# Altium schematic sheet SC945D_Micro.SchDoc: Micro
size 393 x 270 mm; CompanyName: Seccom; Address1: 521, rue du capt. François Garbit; Address2: 69440 Mornant; Address3: seccom@seccom.fr; Address4: www.seccom.fr; DocumentNumber: 4; SheetNumber: 4; SheetTotal: 9; PageSetup: Record=PageOptions|CenterHorizontal=True|CenterVertical=True|PrintScale=0.74|XCorrection=1.00|YCorrection=1.00|PrintKind=0|BorderSize=5000000|LeftOffset=0|BottomOffset=0|Orientation=2|PaperLength=1000|PaperWidth=1000|Scale=100|PaperSource=7|PrintQuality=-4|MediaType=1|DitherType=10|PaperKind=A4|PrintScaleMode=1
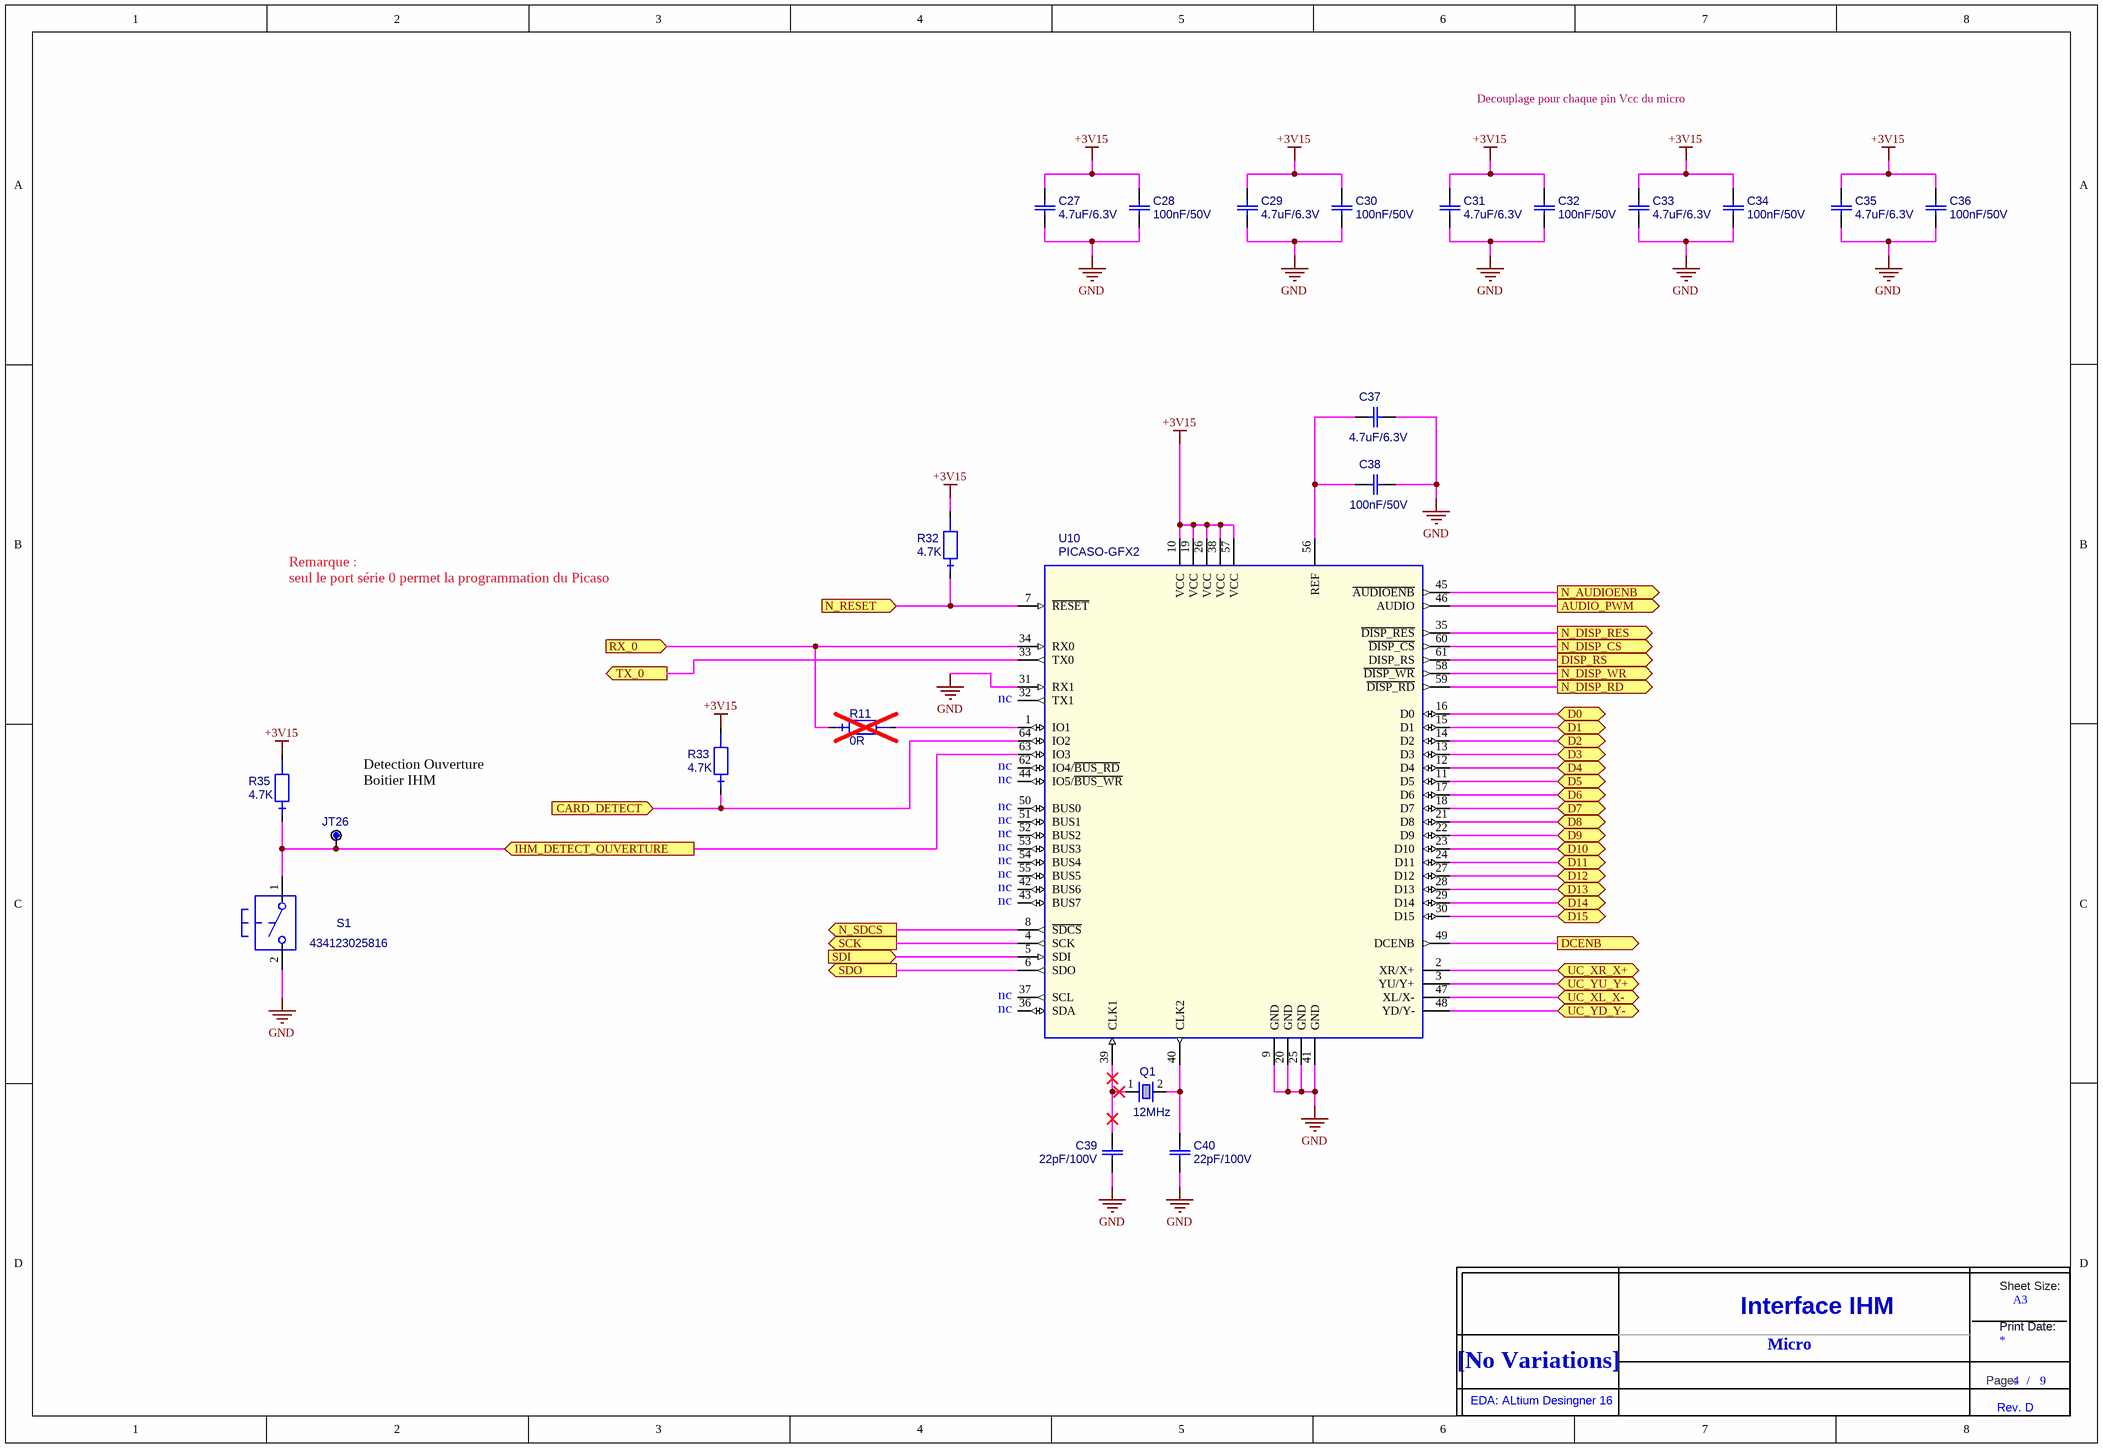
[diagram p0: SC945D_Micro.SchDoc]

## Parts
C27  value 4.7uF/6.3V  [0603_ReflowSoldering_CAP]  (hidden comment: C_0603_X5R_10%_4.7U-6.3V)
C28  value 100nF/50V  [0603_ReflowSoldering_CAP]  (hidden comment: C_0603_X7R_10%_100N-50V)
C29  value 4.7uF/6.3V  [0603_ReflowSoldering_CAP]  (hidden comment: C_0603_X5R_10%_4.7U-6.3V)
C30  value 100nF/50V  [0603_ReflowSoldering_CAP]  (hidden comment: C_0603_X7R_10%_100N-50V)
C31  value 4.7uF/6.3V  [0603_ReflowSoldering_CAP]  (hidden comment: C_0603_X5R_10%_4.7U-6.3V)
C32  value 100nF/50V  [0603_ReflowSoldering_CAP]  (hidden comment: C_0603_X7R_10%_100N-50V)
C33  value 4.7uF/6.3V  [0603_ReflowSoldering_CAP]  (hidden comment: C_0603_X5R_10%_4.7U-6.3V)
C34  value 100nF/50V  [0603_ReflowSoldering_CAP]  (hidden comment: C_0603_X7R_10%_100N-50V)
C35  value 4.7uF/6.3V  [0603_ReflowSoldering_CAP]  (hidden comment: C_0603_X5R_10%_4.7U-6.3V)
C36  value 100nF/50V  [0603_ReflowSoldering_CAP]  (hidden comment: C_0603_X7R_10%_100N-50V)
C37  value 4.7uF/6.3V  [0603_ReflowSoldering_CAP]  (hidden comment: C_0603_X5R_10%_4.7U-6.3V)
C38  value 100nF/50V  [0603_ReflowSoldering_CAP]  (hidden comment: C_0603_X7R_10%_100N-50V)
C39  value 22pF/100V  [0805_ReflowSoldering_CAP]  (hidden comment: C_0805_NPO_5%_22P-100V)
C40  value 22pF/100V  [0805_ReflowSoldering_CAP]  (hidden comment: C_0805_NPO_5%_22P-100V)
JT26  POINT_TEST_PAD_40MIL  [PAD_CMS_40X40_E]  (value not drawn)  (no BOM)
Q1  value 12MHz  [QUARTZ_HC49_11.5X5_CMS]  (hidden comment: QUARTZ_HC49/4HSMX_12M)
R11  value 0R  [0603_ReflowSoldering_RES]  (hidden comment: RES_0603_1%_100PPM_0R)  (no BOM)
R32  value 4.7K  [0603_ReflowSoldering_RES]  (hidden comment: RES_0603_1%_100PPM_4.7K)
R33  value 4.7K  [0603_ReflowSoldering_RES]  (hidden comment: RES_0603_1%_100PPM_4.7K)
R35  value 4.7K  [0603_ReflowSoldering_RES]  (hidden comment: RES_0603_1%_100PPM_4.7K)
S1  value 434123025816  [SWITCH_ON_MOM_WS_TRS_CMS]  (hidden comment: INTP_D_1C-1P_ON-MOM_434123025816)
Title_new?  DNI  (value not drawn)  (graphical)
U10  PICASO-GFX2  [QFP_064_E0,50_10X10MM]

## Ports
AUDIO_PWM (out), CARD_DETECT (in), D0 (bidir), D1 (bidir), D2 (bidir), D3 (bidir), D4 (bidir), D5 (bidir), D6 (bidir), D7 (bidir), D8 (bidir), D9 (bidir), D10 (bidir), D11 (bidir), D12 (bidir), D13 (bidir), D14 (bidir), D15 (bidir), DCENB (out), DISP_RS (out), IHM_DETECT_OUVERTURE (in), N_AUDIOENB (out), N_DISP_CS (out), N_DISP_RD (out), N_DISP_RES (out), N_DISP_WR (out), N_RESET (in), N_SDCS (out), RX_0 (in), SCK (out), SDI (in), SDO (out), TX_0 (out), UC_XL_X- (bidir), UC_XR_X+ (bidir), UC_YD_Y- (bidir), UC_YU_Y+ (bidir)

## Nets
+3V15: C27.2 C28.2 C29.2 C30.2 C31.2 C32.2 C33.2 C34.2 C35.2 C36.2 R32.2 R33.2 R35.2 U10.10(VCC) U10.19(VCC) U10.26(VCC) U10.38(VCC) U10.57(VCC)
GND: C27.1 C28.1 C29.1 C30.1 C31.1 C32.1 C33.1 C34.1 C35.1 C36.1 C37.1 C38.1 C39.1 C40.1 S1.2 U10.9(GND) U10.20(GND) U10.25(GND) U10.31(RX1) U10.41(GND)
AUDIO_PWM: U10.46(AUDIO) ; port AUDIO_PWM
CARD_DETECT: R33.1 U10.64(IO2) ; port CARD_DETECT
D0: U10.16(D0) ; port D0
D1: U10.15(D1) ; port D1
D2: U10.14(D2) ; port D2
D3: U10.13(D3) ; port D3
D4: U10.12(D4) ; port D4
D5: U10.11(D5) ; port D5
D6: U10.17(D6) ; port D6
D7: U10.18(D7) ; port D7
D8: U10.21(D8) ; port D8
D9: U10.22(D9) ; port D9
D10: U10.23(D10) ; port D10
D11: U10.24(D11) ; port D11
D12: U10.27(D12) ; port D12
D13: U10.28(D13) ; port D13
D14: U10.29(D14) ; port D14
D15: U10.30(D15) ; port D15
DCENB: U10.49(DCENB) ; port DCENB
DISP_RS: U10.61(DISP_RS) ; port DISP_RS
IHM_DETECT_OUVERTURE: JT26.1 R35.1 S1.1 U10.63(IO3) ; port IHM_DETECT_OUVERTURE
N_AUDIOENB: U10.45(~{AUDIOENB}) ; port N_AUDIOENB
N_DISP_CS: U10.60(~{DISP_CS}) ; port N_DISP_CS
N_DISP_RD: U10.59(~{DISP_RD}) ; port N_DISP_RD
N_DISP_RES: U10.35(~{DISP_RES}) ; port N_DISP_RES
N_DISP_WR: U10.58(~{DISP_WR}) ; port N_DISP_WR
N_RESET: R32.1 U10.7(~{RESET}) ; port N_RESET
N_SDCS: U10.8(~{SDCS}) ; port N_SDCS
RX_0: R11.1 U10.34(RX0) ; port RX_0
SCK: U10.4(SCK) ; port SCK
SDI: U10.5(SDI) ; port SDI
SDO: U10.6(SDO) ; port SDO
TX_0: U10.33(TX0) ; port TX_0
UC_XL_X-: U10.47(XL/X-) ; port UC_XL_X-
UC_XR_X+: U10.2(XR/X+) ; port UC_XR_X+
UC_YD_Y-: U10.48(YD/Y-) ; port UC_YD_Y-
UC_YU_Y+: U10.3(YU/Y+) ; port UC_YU_Y+
NetC37_2: C37.2 C38.2 U10.56(REF)
NetC39_2: C39.2 Q1.1 U10.39(CLK1)
NetC40_2: C40.2 Q1.2 U10.40(CLK2)
NetR11_2: R11.2 U10.1(IO1)

Not connected (* = marked no-connect by the designer): U10 32(TX1) 36(SDA) 37(SCL) 42(BUS6) 43(BUS7) 44(IO5/~{BUS_WR}) 50(BUS0) 51(BUS1) 52(BUS2) 53(BUS3) 54(BUS4) 55(BUS5) 62(IO4/~{BUS_RD})

## Notes on the sheet
- Decouplage pour chaque pin Vcc du micro
- Remarque :
  seul le port série 0 permet la programmation du Picaso
- (near U10) nc
- (near JT26) Detection Ouverture
  Boitier IHM
- Micro
- (in symbol Title_new) Sheet Size:; A3; Interface IHM; Print Date:; [No Variations]; Page:; /; EDA: ALtium Desingner 16; Rev. D

## Library data of the parts
C27 C29 C31 C33 C35 C37 = C_0603_X5R_10%_4.7U-6.3V: Condensateur céramique, X5R, 10%, CMS 0603, 4.7uF/6.3V; Creation: FB (29/02/12); Boitier: 0603; Remarque: {Remarque}; Fabricant: Kemet; Ref Fab: C0603C475K9PAC; Coeff: 1; ComponentLink1URL: O:\_Documentation\Datasheets\Kemet\Condos_Ceramic_X5R.pdf; ComponentLink2URL: o:\_Documentation\Datasheets\_BOITIERS\PASSIF_CMS\; Config: *; ComponentLink1Description: Datasheet; ComponentLink2Description: Datasheet Boitier; Supplier 1: Farnell; Supplier 2: RadioSpares; Supplier Part Number 1: 9227784; Supplier Part Number 2: 6911164
C28 C30 C32 C34 C36 C38 = C_0603_X7R_10%_100N-50V: Condensateur céramique, X7R, 10%, CMS 0603, 100nF/50V; Creation: FB (29/02/12); Boitier: 0603; Remarque: {Remarque}; Fabricant: Kemet; Ref Fab: C0603C104K5RAC; Coeff: 1; ComponentLink1URL: O:\_Documentation\Datasheets\Kemet\Condos_Ceramic_CMS.pdf; ComponentLink2URL: o:\_Documentation\Datasheets\_BOITIERS\PASSIF_CMS\; Config: *; ComponentLink1Description: Datasheet; ComponentLink2Description: Datasheet Boitier; Supplier 1: Farnell; Supplier Part Number 1: 1288255
C39 C40 = C_0805_NPO_5%_22P-100V: Condensateur céramique, NPO, 5%, CMS 0805; Creation: LJ; Verification: LJ (28/05/04); Boitier: 0805; Remarque: {Remarque}; Coeff: 1; Fabricant: AVX; Ref Fab: 08051A220JAT2A; ComponentLink1URL: o:\_Documentation\Datasheets\BC_Components\Condo_CMS_NPO-X7R-Y5V.pdf; ComponentLink2URL: o:\_Documentation\Datasheets\_BOITIERS\PASSIF_CMS\RC_0805_(2x1,25)_(Schneider).PDF; Config: *; ComponentLink1Description: Datasheet; ComponentLink2Description: Datasheet Boitier; Supplier 1: Farnell; Supplier 2: Mouser; Supplier Part Number 1: 317500; Supplier Part Number 2: 581-08051A220J
JT26 = POINT_TEST_PAD_40MIL: Point de test sur CI, pad de diamètre 1.016mm (40mils); Creation: FB (04/10/12); Remarque: {Remarque}; Coeff: 1; Value: POINT_TEST; Config: *; ComponentLink1Description: Datasheet; ComponentLink2Description: Datasheet Boitier
Q1 = QUARTZ_HC49/4HSMX_12M: Quartz CMS série HCM49 (équiv HC49/US), -10/+60°C, +/-30ppm, 18pF; Creation: FB (11/09/12); Fabricant: Citizen; Ref Fab: HCM49 12.000MABJ-UT; Coeff: 1; Verification: *; Boitier: HC49/4HSMX; Remarque: *; ComponentLink1URL: O:\_Documentation\Datasheets\Citizen\Quartz_HC49-US_HCM49.pdf; ComponentLink2URL: o:\_Documentation\Datasheets\_BOITIERS\; Config: *; ComponentLink1Description: Datasheet; ComponentLink2Description: Datasheet Boitier; Supplier 1: Farnell; Supplier Part Number 1: 1652567; Supplier 2: Mouser; Supplier Part Number 2: 695-HCM49-12-U
R11 = RES_0603_1%_100PPM_0R: Résistance, 0.100W, 1%, 100ppm, 75V, 0R; Creation: FB (04/07/12); Boitier: 0603; Remarque: {Remarque}; Fabricant: Vishay; Ref Fab: CRCW06030000Z0EA; Coeff: 1; Verification: *; ComponentLink1URL: O:\_Documentation\Datasheets\Vishay\Resistances_D-CRCWe3.pdf; ComponentLink2URL: o:\_Documentation\Datasheets\_BOITIERS\PASSIF_CMS\; Config: *; ComponentLink1Description: Datasheet; ComponentLink2Description: Datasheet Boitier; Supplier 1: Farnell; Supplier Part Number 1: 1469739
R32 R33 R35 = RES_0603_1%_100PPM_4.7K: Résistance, 0.100W, 1%, 100ppm, 75V, 4.7K; Creation: JPL (05/07/12); Boitier: 0603; Remarque: {Remarque}; Fabricant: Vishay; Ref Fab: CRCW06034K70FKEA; Coeff: 1; Verification: *; ComponentLink1URL: O:\_Documentation\Datasheets\Vishay\Resistances_D-CRCWe3.pdf; ComponentLink2URL: o:\_Documentation\Datasheets\_BOITIERS\PASSIF_CMS\; Config: *; ComponentLink1Description: Datasheet; ComponentLink2Description: Datasheet Boitier; Supplier 1: Farnell; Supplier 2: RadioSpares; Supplier Part Number 1: 1469807; Supplier Part Number 2: 6790484
S1 = INTP_D_1C-1P_ON-MOM_434123025816: Bouton poussoir, CI, 1 circuit, ON/MOM, droit, tactile, 50mA/12V, -40/+85°C, noir, CMS; Creation: FB (31/07/13); Boitier: WS-TRS_6x3.8_h1.7_Db1.9_Hb2.5mm; Remarque: {Remarque}; Coeff: 1; Fabricant: Wurth Elektronik; Verification: *; ComponentLink1URL: O:\_Documentation\Datasheets\Wurth_Elektronik\434123025816.pdf; Config: *; ComponentLink1Description: Datasheet; ComponentLink2Description: Datasheet Boitier; Ref Fab: 434123025816; Supplier 1: Farnell; Supplier Part Number 1: 1867993
Title_new? = Title_new
U10 = PICASO-GFX2: Contrôleur ASIC graphique & audio 4DGL intégré, pour écrans OLED/LCD/TFT couleurs tactiles, 16bits, CMS; Creation: FB (28/02/2012); Verification: LJ (25/06/12); Boitier: QFP64_e0.50_10x10mm; Remarque: {Remarque}; Fabricant: 4D Systems; Coeff: 1; Ref Fab: PICASO-GFX2; Config: *; ComponentLink1Description: Datasheet; ComponentLink1URL: O:\_Documentation\Datasheets\4D_Systems\PICASO-GFX2-DS-rev4.pdf; ComponentLink2Description: Datasheet Boitier; ComponentLink2URL: o:\_Documentation\Datasheets\_Boitiers\ACTIF_CMS\QFP\QFP_064_e0,50_10x10mm_(Schneider).PDF; Value: PICASO-GFX2